# Altium project Audio_Research.PrjPcb (part 1 of 4)
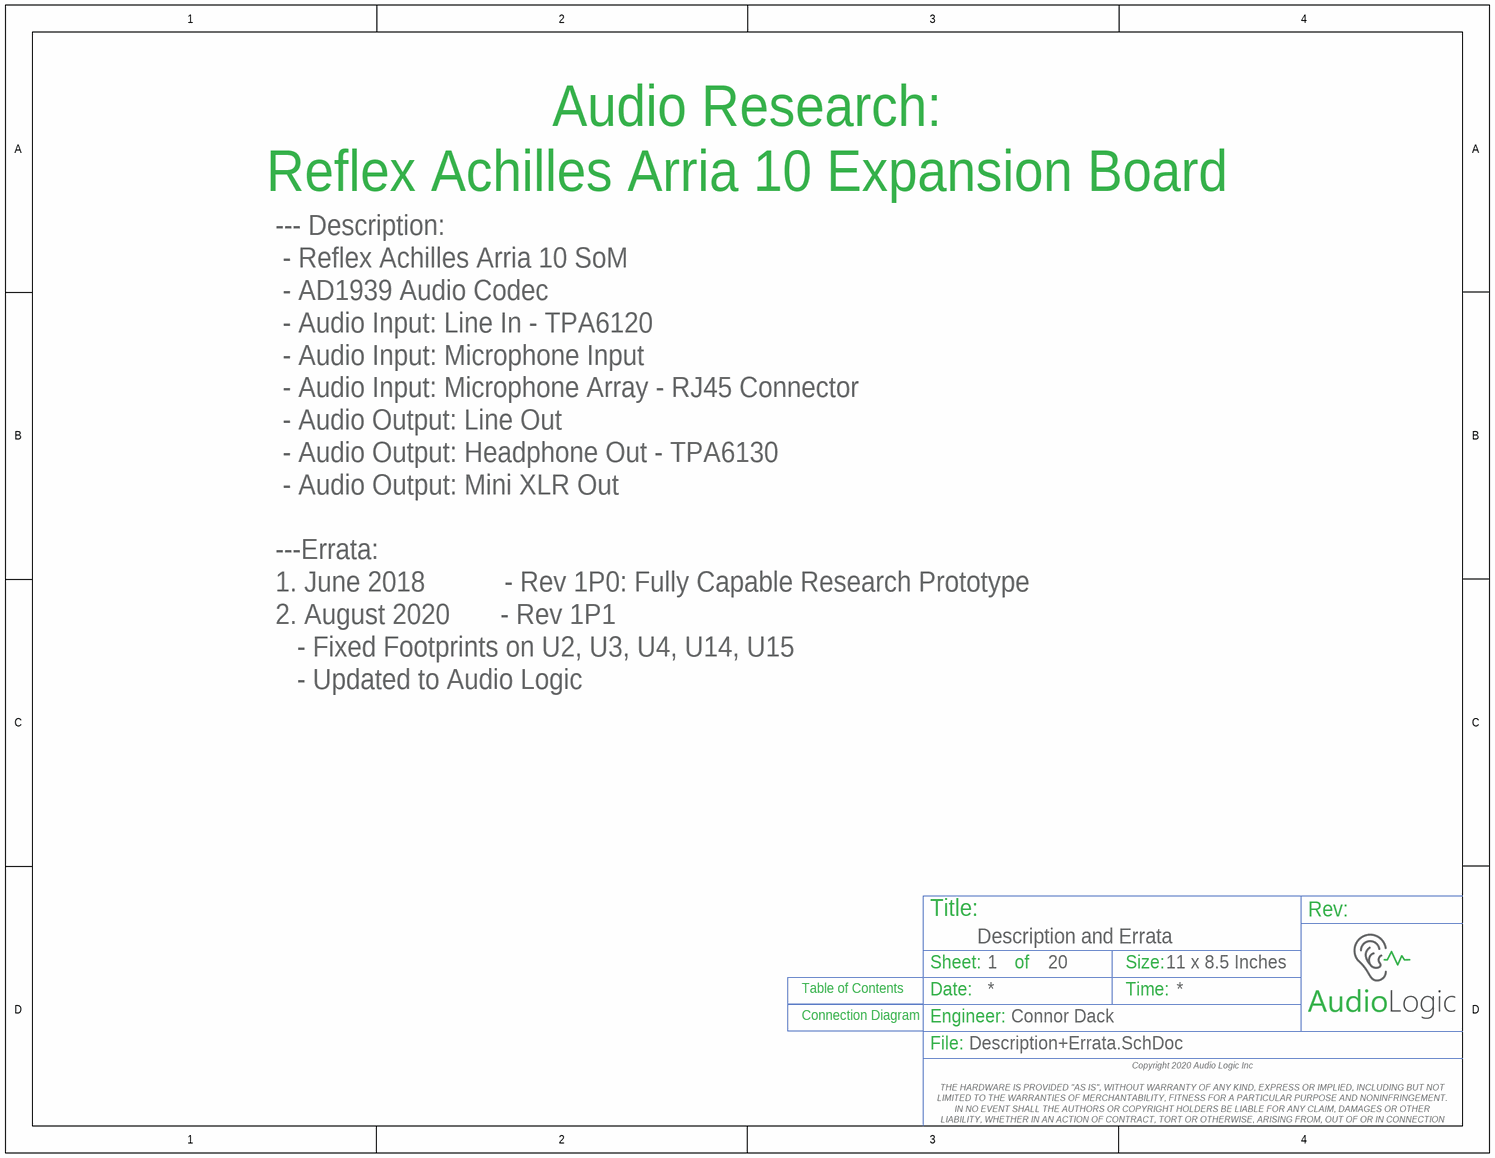
[diagram p0: Description+Errata.SchDoc]
15 sheets, 244 parts. Net scope: flat (ports and power ports of the same name join across sheets).
Board file: Audio_Research.PcbDoc
Sheets:
  Description+Errata.SchDoc
    Table of Contents = ToC.SchDoc
    Connection Diagram = TopLevel.SchDoc
      AUDIO CODEC = Audio_Codec.SchDoc
      LINE IN = Audio_Input_Line_In.SchDoc
      POWER = Power.SchDoc
      LINE OUT = Audio_Output_Line_Out.SchDoc
      BALANCED MINI XLR 1 = Audio_Output_XLR1.SchDoc
      BALANCED MINI XLR 2 = Audio_Output_XLR2.SchDoc
      MICROPHONE IN = Audio_Input_Mic_In.SchDoc
      MEMS MICROPHONE ARRAY = Audio_Input_Mic_Array.SchDoc
      MICROPHONE PREAMP = Audio_Input_Mic_Preamp.SchDoc
      Digital MEMS Microphones = Audio_Input_Digitial_Mic.SchDoc
      FMC BLOCK DIAGRAM = FMC_Block_Diagram.SchDoc
        TOP LPC FEMALE FMC CONN = LPC_Female_FMC.SchDoc

## Sheet Description+Errata.SchDoc: Description and Errata
size 279 x 215 mm; DrawnBy: Connor Dack; Engineer: Connor Dack; DocumentNumber: 1; Revision: 1.0; SheetNumber: 1; SheetTotal: 20

### Sub-sheets
Connection Diagram = TopLevel.SchDoc: no entries
Table of Contents = ToC.SchDoc: no entries

### Notes on the sheet
- Audio Research:
  Reflex Achilles Arria 10 Expansion Board
- --- Description:
  - Reflex Achilles Arria 10 SoM
  - AD1939 Audio Codec
  - Audio Input: Line In - TPA6120
  - Audio Input: Microphone Input
  - Audio Input: Microphone Array - RJ45 Connector
  - Audio Output: Line Out
  - Audio Output: Headphone Out - TPA6130
  - Audio Output: Mini XLR Out
  ---Errata:
  1. June 2018           - Rev 1P0: Fully Capable Research Prototype
  2. August 2020       - Rev 1P1
  - Fixed Footprints on U2, U3, U4, U14, U15
  - Updated to Audio Logic
- Title:
- Sheet:
- of
- Size:
- 11 x 8.5 Inches
- Rev:
- Date:
- Engineer:
- Time:
- File:
- Copyright 2020 Audio Logic Inc
  THE HARDWARE IS PROVIDED "AS IS", WITHOUT WARRANTY OF ANY KIND, EXPRESS OR IMPLIED, INCLUDING BUT NOT LIMITED TO THE WARRANTIES OF MERCHANTABILITY, FITNESS FOR A PARTICULAR PURPOSE AND NONINFRINGEMENT. IN NO EVENT SHALL THE AUTHORS OR COPYRIGHT HOLDERS BE LIABLE FOR ANY CLAIM, DAMAGES OR OTHER LIABILITY, WHETHER IN AN ACTION OF CONTRACT, TORT OR OTHERWISE, ARISING FROM, OUT OF OR IN CONNECTION WITH THE HARDWARE OR THE USE OR OTHER DEALINGS IN THE HARDWARE.

## Sheet ToC.SchDoc: Table of Contents
size 279 x 215 mm; DrawnBy: Connor Dack; Engineer: Connor Dack; DocumentNumber: 2; Revision: 1P2; SheetNumber: 2; SheetTotal: 20
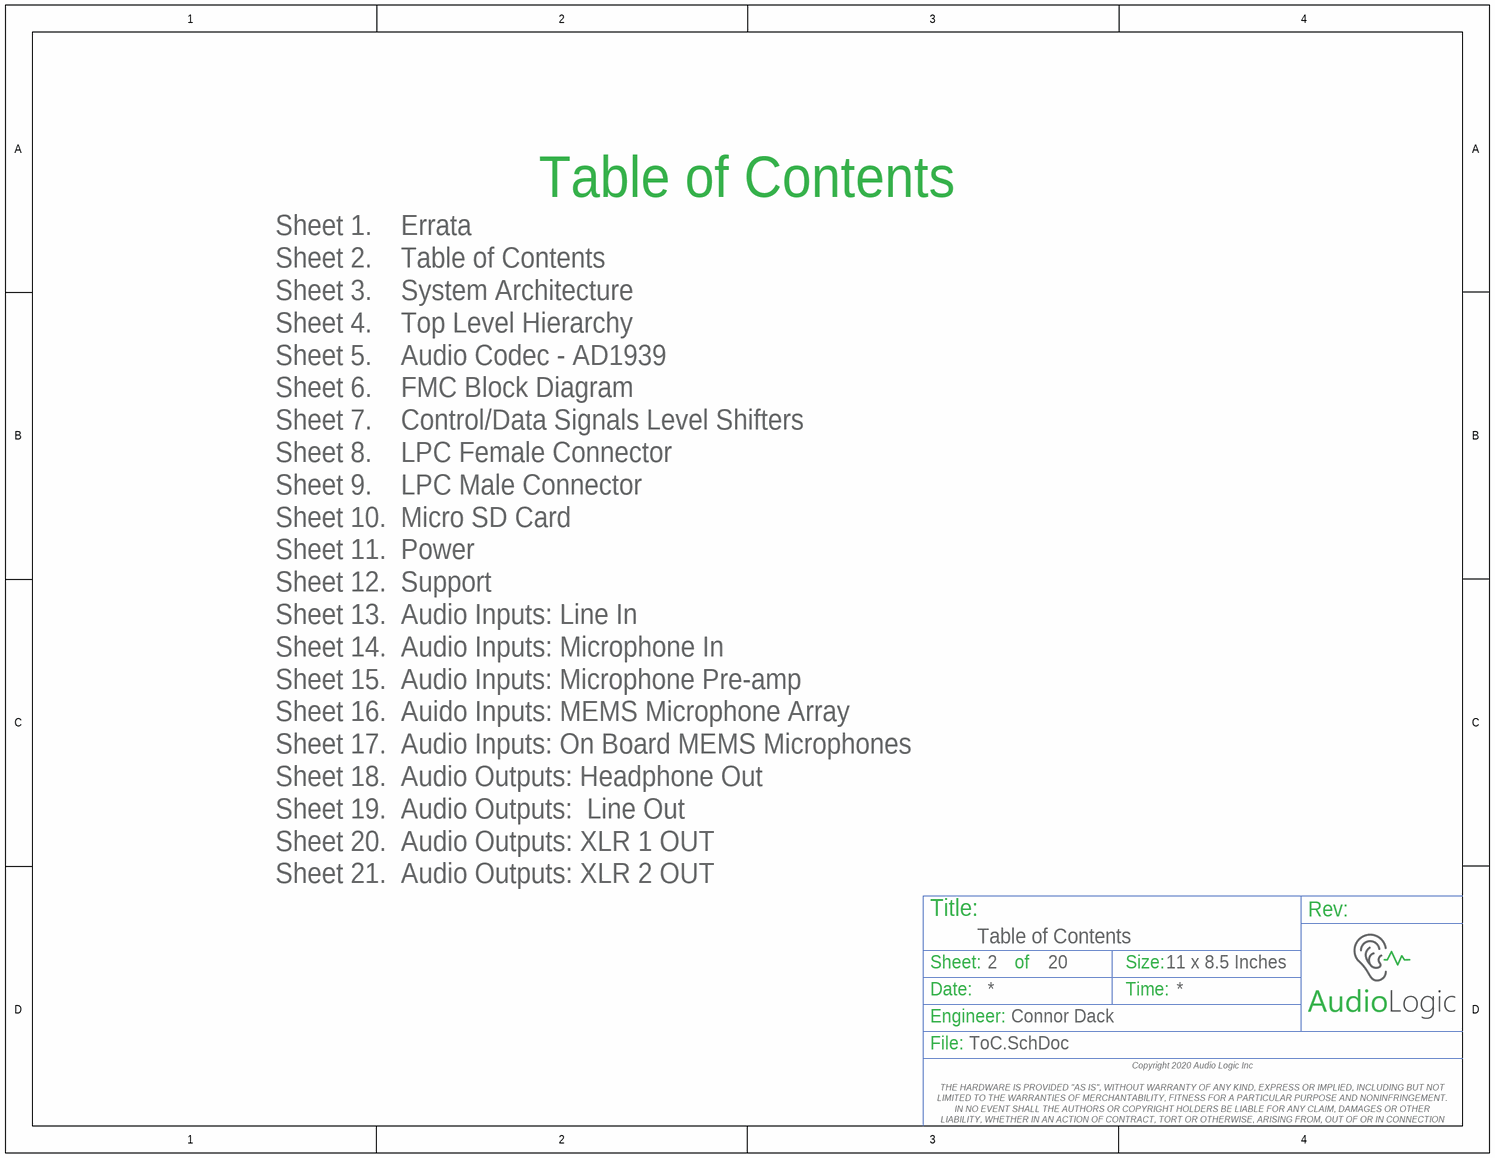
[diagram p1: ToC.SchDoc]

### Notes on the sheet
- Table of Contents
- Sheet 1.    Errata
  Sheet 2.    Table of Contents
  Sheet 3.    System Architecture
  Sheet 4.    Top Level Hierarchy
  Sheet 5.    Audio Codec - AD1939
  Sheet 6.    FMC Block Diagram
  Sheet 7.    Control/Data Signals Level Shifters
  Sheet 8.    LPC Female Connector
  Sheet 9.    LPC Male Connector
  Sheet 10.  Micro SD Card
  Sheet 11.  Power
  Sheet 12.  Support
  Sheet 13.  Audio Inputs: Line In
  Sheet 14.  Audio Inputs: Microphone In
  Sheet 15.  Audio Inputs: Microphone Pre-amp
  Sheet 16.  Auido Inputs: MEMS Microphone Array
  Sheet 17.  Audio Inputs: On Board MEMS Microphones
  Sheet 18.  Audio Outputs: Headphone Out
  Sheet 19.  Audio Outputs:  Line Out
  Sheet 20.  Audio Outputs: XLR 1 OUT
  Sheet 21.  Audio Outputs: XLR 2 OUT
- Title:
- Sheet:
- of
- Size:
- 11 x 8.5 Inches
- Rev:
- Date:
- Engineer:
- Time:
- File:
- Copyright 2020 Audio Logic Inc
  THE HARDWARE IS PROVIDED "AS IS", WITHOUT WARRANTY OF ANY KIND, EXPRESS OR IMPLIED, INCLUDING BUT NOT LIMITED TO THE WARRANTIES OF MERCHANTABILITY, FITNESS FOR A PARTICULAR PURPOSE AND NONINFRINGEMENT. IN NO EVENT SHALL THE AUTHORS OR COPYRIGHT HOLDERS BE LIABLE FOR ANY CLAIM, DAMAGES OR OTHER LIABILITY, WHETHER IN AN ACTION OF CONTRACT, TORT OR OTHERWISE, ARISING FROM, OUT OF OR IN CONNECTION WITH THE HARDWARE OR THE USE OR OTHER DEALINGS IN THE HARDWARE.

## Sheet TopLevel.SchDoc: Top Level Hierarchy
size 279 x 215 mm; DrawnBy: Connor Dack; DocumentNumber: 3; Revision: 1.0; SheetNumber: 3; SheetTotal: 20
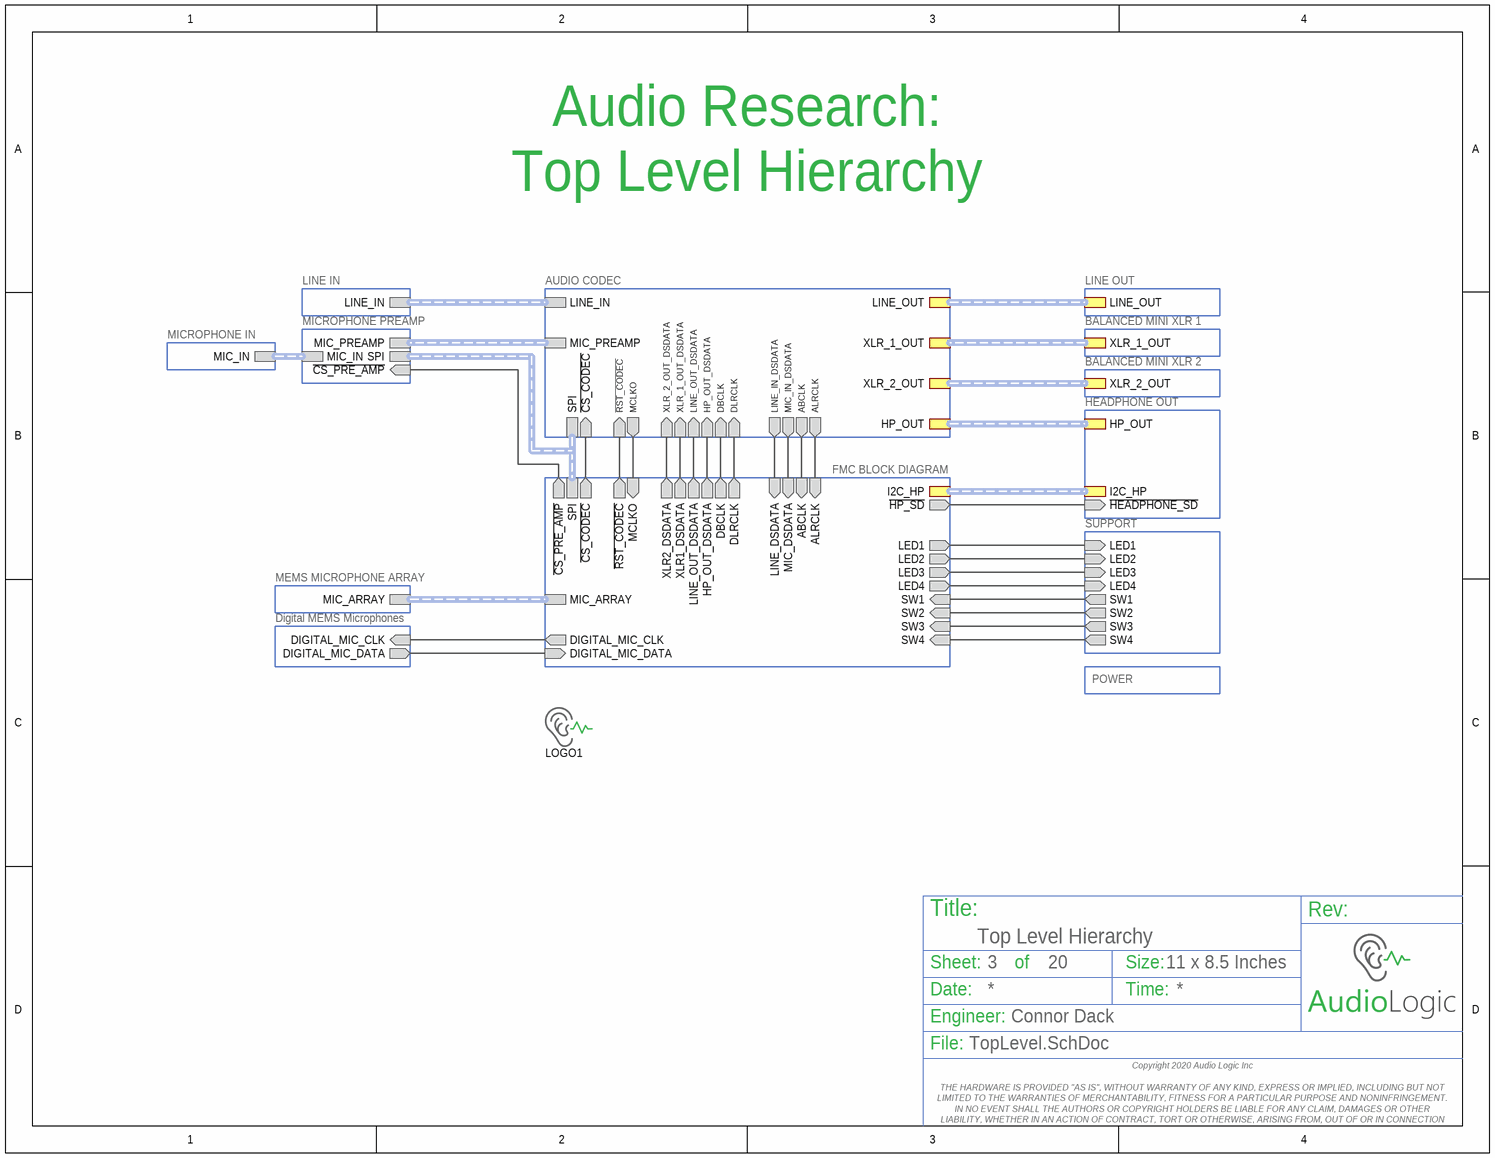
[diagram p2: TopLevel.SchDoc]

### Parts
LOGO1  Audio Logic Logo  [AL_Logo_Small_Silkscreen]  (value not drawn)  (no BOM)

### Sub-sheets
AUDIO CODEC = Audio_Codec.SchDoc: MIC_IN_DSDATA (out), ABCLK (out), ALRCLK (out), DBCLK (in), DLRCLK (in), MCLKO (out), ~{RST_CODEC} (in), HP_OUT_DSDATA (in), LINE_IN (harness LINE_IN), HP_OUT (harness HP_OUT), XLR_1_OUT_DSDATA (in), LINE_IN_DSDATA (out), LINE_OUT_DSDATA (in), XLR_2_OUT_DSDATA (in), LINE_OUT (harness LINE_OUT), MIC_PREAMP (harness MIC_PREAMP), XLR_1_OUT (harness XLR_1_OUT), SPI (harness SPI), ~{CS_CODEC} (in), XLR_2_OUT (harness XLR_2_OUT)
BALANCED MINI XLR 1 = Audio_Output_XLR1.SchDoc: XLR_1_OUT (harness MIC_IN)
BALANCED MINI XLR 2 = Audio_Output_XLR2.SchDoc: XLR_2_OUT (harness XLR_2_OUT)
Digital MEMS Microphones = Audio_Input_Digitial_Mic.SchDoc: DIGITAL_MIC_CLK (in), DIGITAL_MIC_DATA (out)
FMC BLOCK DIAGRAM = FMC_Block_Diagram.SchDoc: DIGITAL_MIC_CLK (out), DIGITAL_MIC_DATA (in), MIC_ARRAY (harness Microphone Array), LED1 (out), LED2 (out), LED3 (out), LED4 (out), SW1 (in), SW2 (in), SW3 (in), SW4 (in), ~{HP_SD} (out), ~{CS_PRE_AMP} (out), ~{CS_CODEC} (out), ~{RST_CODEC} (out), XLR2_DSDATA (out), DBCLK (out), DLRCLK (out), LINE_DSDATA (in), MIC_DSDATA (in), ABCLK (in), ALRCLK (in), XLR1_DSDATA (out), LINE_OUT_DSDATA (out), HP_OUT_DSDATA (out), SPI (harness SPI), I2C_HP (harness I2C_Headphone), MCLKO (in)
HEADPHONE OUT = Audio_Output_Headphone.SchDoc (file not in this document): HP_OUT (harness HP_OUT), ~{HEADPHONE_SD} (in), I2C_HP (harness I2C_Headphone)
LINE IN = Audio_Input_Line_In.SchDoc: LINE_IN (harness MIC_IN)
LINE OUT = Audio_Output_Line_Out.SchDoc: LINE_OUT (harness MIC_IN)
MEMS MICROPHONE ARRAY = Audio_Input_Mic_Array.SchDoc: MIC_ARRAY (harness Microphone Array)
MICROPHONE IN = Audio_Input_Mic_In.SchDoc: MIC_IN (harness MIC_IN)
MICROPHONE PREAMP = Audio_Input_Mic_Preamp.SchDoc: MIC_PREAMP (harness MIC_PREAMP), SPI (harness SPI), ~{CS_PRE_AMP} (in), MIC_IN (harness MIC_IN)
POWER = Power.SchDoc: no entries
SUPPORT = Support.SchDoc (file not in this document): SW1 (out), SW2 (out), SW3 (out), SW4 (out), LED1 (in), LED2 (in), LED3 (in), LED4 (in)

### Nets
(unnamed): sheet AUDIO CODEC/MIC_IN_DSDATA, sheet FMC BLOCK DIAGRAM/MIC_DSDATA
(unnamed): sheet AUDIO CODEC/ABCLK, sheet FMC BLOCK DIAGRAM/ABCLK
(unnamed): sheet AUDIO CODEC/ALRCLK, sheet FMC BLOCK DIAGRAM/ALRCLK
(unnamed): sheet AUDIO CODEC/DBCLK, sheet FMC BLOCK DIAGRAM/DBCLK
(unnamed): sheet AUDIO CODEC/DLRCLK, sheet FMC BLOCK DIAGRAM/DLRCLK
(unnamed): sheet AUDIO CODEC/MCLKO, sheet FMC BLOCK DIAGRAM/MCLKO
(unnamed): sheet AUDIO CODEC/~{RST_CODEC}, sheet FMC BLOCK DIAGRAM/~{RST_CODEC}
(unnamed): sheet AUDIO CODEC/HP_OUT_DSDATA, sheet FMC BLOCK DIAGRAM/HP_OUT_DSDATA
(unnamed): sheet AUDIO CODEC/XLR_1_OUT_DSDATA, sheet FMC BLOCK DIAGRAM/XLR1_DSDATA
(unnamed): sheet AUDIO CODEC/LINE_IN_DSDATA, sheet FMC BLOCK DIAGRAM/LINE_DSDATA
(unnamed): sheet AUDIO CODEC/LINE_OUT_DSDATA, sheet FMC BLOCK DIAGRAM/LINE_OUT_DSDATA
(unnamed): sheet AUDIO CODEC/XLR_2_OUT_DSDATA, sheet FMC BLOCK DIAGRAM/XLR2_DSDATA
(unnamed): sheet AUDIO CODEC/~{CS_CODEC}, sheet FMC BLOCK DIAGRAM/~{CS_CODEC}
(unnamed): sheet HEADPHONE OUT/~{HEADPHONE_SD}, sheet FMC BLOCK DIAGRAM/~{HP_SD}
(unnamed): sheet SUPPORT/SW1, sheet FMC BLOCK DIAGRAM/SW1
(unnamed): sheet SUPPORT/SW2, sheet FMC BLOCK DIAGRAM/SW2
(unnamed): sheet SUPPORT/SW3, sheet FMC BLOCK DIAGRAM/SW3
(unnamed): sheet SUPPORT/SW4, sheet FMC BLOCK DIAGRAM/SW4
(unnamed): sheet SUPPORT/LED1, sheet FMC BLOCK DIAGRAM/LED1
(unnamed): sheet SUPPORT/LED2, sheet FMC BLOCK DIAGRAM/LED2
(unnamed): sheet SUPPORT/LED3, sheet FMC BLOCK DIAGRAM/LED3
(unnamed): sheet SUPPORT/LED4, sheet FMC BLOCK DIAGRAM/LED4
(unnamed): sheet MICROPHONE PREAMP/~{CS_PRE_AMP}, sheet FMC BLOCK DIAGRAM/~{CS_PRE_AMP}
(unnamed): sheet Digital MEMS Microphones/DIGITAL_MIC_CLK, sheet FMC BLOCK DIAGRAM/DIGITAL_MIC_CLK
(unnamed): sheet Digital MEMS Microphones/DIGITAL_MIC_DATA, sheet FMC BLOCK DIAGRAM/DIGITAL_MIC_DATA

### Buses and harness runs
harness sheet AUDIO CODEC/HP_OUT = sheet HEADPHONE OUT/HP_OUT
harness sheet AUDIO CODEC/LINE_IN = sheet LINE IN/LINE_IN
harness sheet AUDIO CODEC/LINE_OUT = sheet LINE OUT/LINE_OUT
harness sheet AUDIO CODEC/MIC_PREAMP = sheet MICROPHONE PREAMP/MIC_PREAMP
harness sheet AUDIO CODEC/SPI = sheet FMC BLOCK DIAGRAM/SPI = sheet MICROPHONE PREAMP/SPI
harness sheet AUDIO CODEC/XLR_1_OUT = sheet BALANCED MINI XLR 1/XLR_1_OUT
harness sheet AUDIO CODEC/XLR_2_OUT = sheet BALANCED MINI XLR 2/XLR_2_OUT
harness sheet FMC BLOCK DIAGRAM/I2C_HP = sheet HEADPHONE OUT/I2C_HP
harness sheet FMC BLOCK DIAGRAM/MIC_ARRAY = sheet MEMS MICROPHONE ARRAY/MIC_ARRAY
harness sheet MICROPHONE IN/MIC_IN = sheet MICROPHONE PREAMP/MIC_IN

### Notes on the sheet
- Audio Research:
  Top Level Hierarchy
- Title:
- Sheet:
- of
- Size:
- 11 x 8.5 Inches
- Rev:
- Date:
- Engineer:
- Time:
- File:
- Copyright 2020 Audio Logic Inc
  THE HARDWARE IS PROVIDED "AS IS", WITHOUT WARRANTY OF ANY KIND, EXPRESS OR IMPLIED, INCLUDING BUT NOT LIMITED TO THE WARRANTIES OF MERCHANTABILITY, FITNESS FOR A PARTICULAR PURPOSE AND NONINFRINGEMENT. IN NO EVENT SHALL THE AUTHORS OR COPYRIGHT HOLDERS BE LIABLE FOR ANY CLAIM, DAMAGES OR OTHER LIABILITY, WHETHER IN AN ACTION OF CONTRACT, TORT OR OTHERWISE, ARISING FROM, OUT OF OR IN CONNECTION WITH THE HARDWARE OR THE USE OR OTHER DEALINGS IN THE HARDWARE.

### Library data of the parts
LOGO1 = Audio_Logic_Logo

## Sheet Audio_Codec.SchDoc: Audio Codec
size 279 x 215 mm; DrawnBy: Connor Dack; Engineer: Connor Dack; DocumentNumber: 4; Revision: 1.0; SheetNumber: 4; SheetTotal: 20
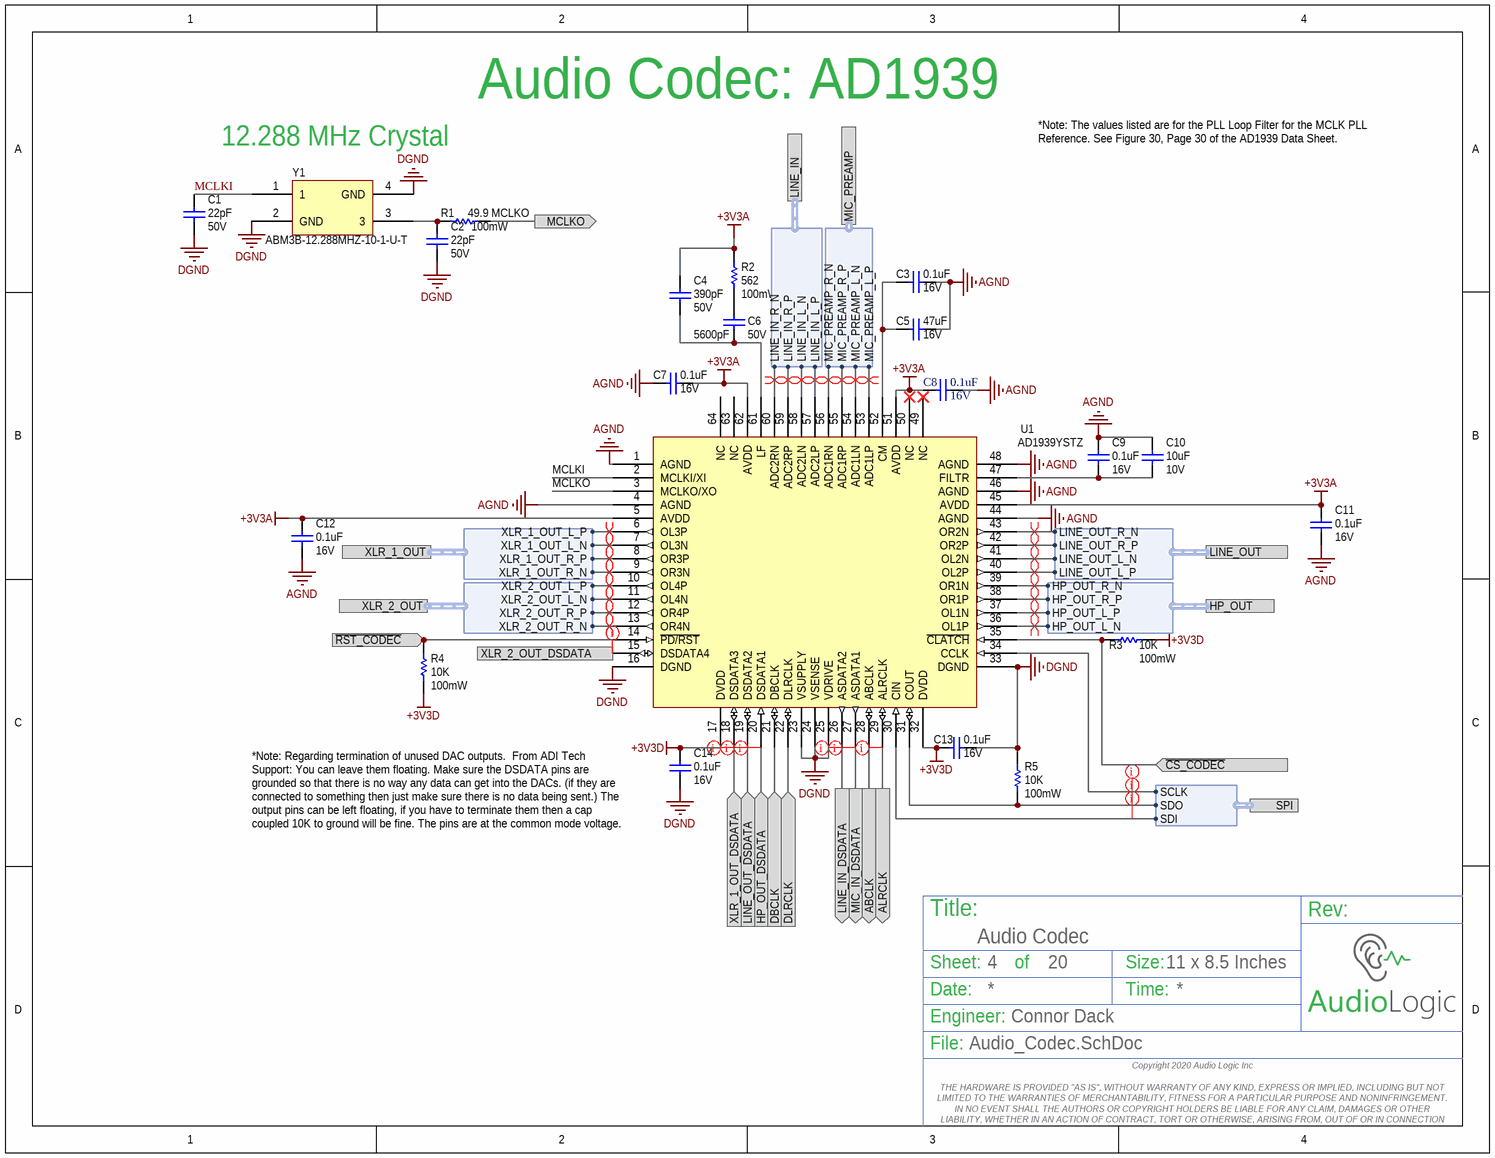
[diagram p3: Audio_Codec.SchDoc]

### Parts
C1  Voltage Rating: 50V  Capacitance: 22pF  [3-0603_L]  (hidden comment: CGA3E2C0G1H220J080AA)
C2  Voltage Rating: 50V  Capacitance: 22pF  [3-0603_L]  (hidden comment: CGA3E2C0G1H220J080AA)
C3  Voltage Rating: 16V  Capacitance: 0.1uF  [3-0603_L]  (hidden comment: CL10F104ZO8NNNC)
C4  Voltage - Rated: 50V  Capacitance: 390pF  [3-0603_L]  (hidden comment: CL10B391KB8NNNC)
C5  Voltage Rating: 16V  Capacitance: 47uF  [C1210X25_L]  (hidden comment: CL32A476KOJNNNE)
C6  Voltage - Rated: 50V  Capacitance: 5600pF  [3-0603_L]  (hidden comment: CL10B562KB8SFNC)
C7  Voltage Rating: 16V  Capacitance: 0.1uF  [3-0603_L]  (hidden comment: CL10F104ZO8NNNC)
C8  Voltage Rating: 16V  Capacitance: 0.1uF  [3-0603_L]  (hidden comment: CL10F104ZO8NNNC)
C9  Voltage Rating: 16V  Capacitance: 0.1uF  [3-0603_L]  (hidden comment: CL10F104ZO8NNNC)
C10  Voltage Rating: 10V  Capacitance: 10uF  [3-0603_L]  (hidden comment: GRM188R61A106ME69D)
C11  Voltage Rating: 16V  Capacitance: 0.1uF  [3-0603_L]  (hidden comment: CL10F104ZO8NNNC)
C12  Voltage Rating: 16V  Capacitance: 0.1uF  [3-0603_L]  (hidden comment: CL10F104ZO8NNNC)
C13  Voltage Rating: 16V  Capacitance: 0.1uF  [3-0603_L]  (hidden comment: CL10F104ZO8NNNC)
C14  Voltage Rating: 16V  Capacitance: 0.1uF  [3-0603_L]  (hidden comment: CL10F104ZO8NNNC)
R1  Power (Watts): 100mW  Resistance (Ohms): 49.9  [3-0603_R_L]  (hidden comment: ERJ-3EKF49R9V)
R2  Power (Watts): 100mW  Resistance (Ohms): 562  [3-0603_R_L]  (hidden comment: ERJ-3EKF5620V)
R3  Power (Watts): 100mW  Resistance (Ohms): 10K  [3-0603_R_L]  (hidden comment: ERJ-3GEYJ103V)
R4  Power (Watts): 100mW  Resistance (Ohms): 10K  [3-0603_R_L]  (hidden comment: ERJ-3GEYJ103V)
R5  Power (Watts): 100mW  Resistance (Ohms): 10K  [3-0603_R_L]  (hidden comment: ERJ-3GEYJ103V)
U1  AD1939YSTZ  [ST_64_2]
Y1  ABM3B-12.288MHZ-10-1-U-T  [ADM3B]

### Ports
ABCLK (out), ALRCLK (out), DBCLK (in), DLRCLK (in), HP_OUT (harness HP_OUT), HP_OUT_DSDATA (in), LINE_IN (harness LINE_IN), LINE_IN_DSDATA (out), LINE_OUT (harness LINE_OUT), LINE_OUT_DSDATA (in), MCLKO (out), MIC_IN_DSDATA (out), MIC_PREAMP (harness MIC_PREAMP), SPI (harness SPI), XLR_1_OUT (harness XLR_1_OUT), XLR_1_OUT_DSDATA (in), XLR_2_OUT (harness XLR_2_OUT), XLR_2_OUT_DSDATA (in), ~{CS_CODEC} (in), ~{RST_CODEC} (in)

### Harnesses
LINE_IN: LINE_IN_R_P, LINE_IN_R_N, LINE_IN_L_N, LINE_IN_L_P
HP_OUT: HP_OUT_L_N, HP_OUT_L_P, HP_OUT_R_N, HP_OUT_R_P
LINE_OUT: LINE_OUT_L_N, LINE_OUT_L_P, LINE_OUT_R_N, LINE_OUT_R_P
XLR_1_OUT: XLR_1_OUT_L_N, XLR_1_OUT_L_P, XLR_1_OUT_R_N, XLR_1_OUT_R_P
XLR_2_OUT: XLR_2_OUT_L_N, XLR_2_OUT_L_P, XLR_2_OUT_R_N, XLR_2_OUT_R_P
MIC_PREAMP: MIC_PREAMP_R_P, MIC_PREAMP_R_N, MIC_PREAMP_L_N, MIC_PREAMP_L_P
SPI: SDI, SCLK, SDO

### Nets
+3V3A: C4.1 C7.1 C8.2 C11.1 C12.1 R2.1 U1.5(AVDD) U1.45(AVDD) U1.51(AVDD) U1.62(AVDD)
+3V3D: C13.2 C14.1 R3.1 R4.1 U1.17(DVDD) U1.32(DVDD)
AGND: C1.1 C2.1 C3.1 C5.2 C7.2 C8.1 C9.1 C10.2 C11.2 C12.2 C13.1 C14.2 R5.1 U1.1(AGND) U1.4(AGND) U1.16(DGND) U1.23(VSUPPLY) U1.24(VSENSE) U1.25(VDRIVE) U1.33(DGND) U1.44(AGND) U1.46(AGND) U1.48(AGND) Y1.2(GND) Y1.4(GND)  [also labelled DGND]
~{CS_CODEC}: R3.2 U1.35(~{CLATCH}) ; port ~{CS_CODEC}
ABCLK: U1.28(ABCLK) ; port ABCLK
ALRCLK: U1.29(ALRCLK) ; port ALRCLK
DBCLK: U1.21(DBCLK) ; port DBCLK
DLRCLK: U1.22(DLRCLK) ; port DLRCLK
HP_OUT_DSDATA: U1.20(DSDATA1) ; port HP_OUT_DSDATA
LINE_IN_DSDATA: U1.26(ASDATA2) ; port LINE_IN_DSDATA
LINE_OUT_DSDATA: U1.19(DSDATA2) ; port LINE_OUT_DSDATA
MCLKI: C1.2 U1.2(MCLKI/XI) Y1.1
MCLKO: R1.2 U1.3(MCLKO/XO) ; port MCLKO
MIC_IN_DSDATA: U1.27(ASDATA1) ; port MIC_IN_DSDATA
~{RST_CODEC}: R4.2 U1.14(~{PD/RST}) ; port ~{RST_CODEC}
SCLK: U1.34(CCLK) ; port SPI.SCLK
SDI: U1.30(CIN) ; port SPI.SDI
SDO: R5.2 U1.31(COUT) ; port SPI.SDO
XLR_1_OUT_DSDATA: U1.18(DSDATA3) ; port XLR_1_OUT_DSDATA
XLR_2_OUT_DSDATA: U1.15(DSDATA4) ; port XLR_2_OUT_DSDATA
NetC2_2: C2.2 R1.1 Y1.3
NetC3_2: C3.2 C5.1 U1.52(CM)
NetC4_2: C4.2 C6.2 U1.61(LF)
NetC6_1: C6.1 R2.2
NetC9_2: C9.2 C10.1 U1.47(FILTR)
NetC52_1: U1.58(ADC2LN) ; port LINE_IN.LINE_IN_L_N
NetC55_1: U1.57(ADC2LP) ; port LINE_IN.LINE_IN_L_P
NetC62_1: U1.60(ADC2RN) ; port LINE_IN.LINE_IN_R_N
NetC64_1: U1.59(ADC2RP) ; port LINE_IN.LINE_IN_R_P
NetR68_1: U1.40(OL2P) ; port LINE_OUT.LINE_OUT_L_P
NetR70_1: U1.41(OL2N) ; port LINE_OUT.LINE_OUT_L_N
NetR71_1: U1.43(OR2N) ; port LINE_OUT.LINE_OUT_R_N
NetR73_1: U1.42(OR2P) ; port LINE_OUT.LINE_OUT_R_P
NetU1_6: U1.6(OL3P) ; port XLR_1_OUT.XLR_1_OUT_L_P
NetU1_7: U1.7(OL3N) ; port XLR_1_OUT.XLR_1_OUT_L_N
NetU1_8: U1.8(OR3P) ; port XLR_1_OUT.XLR_1_OUT_R_P
NetU1_9: U1.9(OR3N) ; port XLR_1_OUT.XLR_1_OUT_R_N
NetU1_10: U1.10(OL4P) ; port XLR_2_OUT.XLR_2_OUT_L_P
NetU1_11: U1.11(OL4N) ; port XLR_2_OUT.XLR_2_OUT_L_N
NetU1_12: U1.12(OR4P) ; port XLR_2_OUT.XLR_2_OUT_R_P
NetU1_13: U1.13(OR4N) ; port XLR_2_OUT.XLR_2_OUT_R_N
NetU1_36: U1.36(OL1P) ; port HP_OUT.HP_OUT_L_N
NetU1_37: U1.37(OL1N) ; port HP_OUT.HP_OUT_L_P
NetU1_38: U1.38(OR1P) ; port HP_OUT.HP_OUT_R_P
NetU1_39: U1.39(OR1N) ; port HP_OUT.HP_OUT_R_N
NetU1_53: U1.53(ADC1LP) ; port MIC_PREAMP.MIC_PREAMP_L_P
NetU1_54: U1.54(ADC1LN) ; port MIC_PREAMP.MIC_PREAMP_L_N
NetU1_55: U1.55(ADC1RP) ; port MIC_PREAMP.MIC_PREAMP_R_P
NetU1_56: U1.56(ADC1RN) ; port MIC_PREAMP.MIC_PREAMP_R_N

Not connected (* = marked no-connect by the designer): U1 49(NC)* 50(NC)* 63(NC) 64(NC)

### Layout directives
differential pair: NetC52_1, NetC55_1, NetC62_1, NetC64_1, NetR68_1, NetR70_1, NetR71_1, NetR73_1, NetU1_6, NetU1_7, NetU1_8, NetU1_9, NetU1_10, NetU1_11, NetU1_12, NetU1_13, NetU1_36, NetU1_37, NetU1_38, NetU1_39, NetU1_53, NetU1_54, NetU1_55, NetU1_56
net class SPI: SCLK, SDI, SDO
net class FPGA_Audio_In: ALRCLK, LINE_IN_DSDATA, MIC_IN_DSDATA
net class FPGA_Audio_Out: HP_OUT_DSDATA, LINE_OUT_DSDATA, XLR_1_OUT_DSDATA, XLR_2_OUT_DSDATA

### Notes on the sheet
- 12.288 MHz Crystal
- Audio Codec: AD1939
- *Note: The values listed are for the PLL Loop Filter for the MCLK PLL Reference. See Figure 30, Page 30 of the AD1939 Data Sheet.
- *Note: Regarding termination of unused DAC outputs.  From ADI Tech Support: You can leave them floating. Make sure the DSDATA pins are grounded so that there is no way any data can get into the DACs. (if they are connected to something then just make sure there is no data being sent.) The output pins can be left floating, if you have to terminate them then a cap coupled 10K to ground will be fine. The pins are at the common mode voltage.
- Title:
- Sheet:
- of
- Size:
- 11 x 8.5 Inches
- Rev:
- Date:
- Engineer:
- Time:
- File:
- Copyright 2020 Audio Logic Inc
  THE HARDWARE IS PROVIDED "AS IS", WITHOUT WARRANTY OF ANY KIND, EXPRESS OR IMPLIED, INCLUDING BUT NOT LIMITED TO THE WARRANTIES OF MERCHANTABILITY, FITNESS FOR A PARTICULAR PURPOSE AND NONINFRINGEMENT. IN NO EVENT SHALL THE AUTHORS OR COPYRIGHT HOLDERS BE LIABLE FOR ANY CLAIM, DAMAGES OR OTHER LIABILITY, WHETHER IN AN ACTION OF CONTRACT, TORT OR OTHERWISE, ARISING FROM, OUT OF OR IN CONNECTION WITH THE HARDWARE OR THE USE OR OTHER DEALINGS IN THE HARDWARE.

### Library data of the parts
C1 C2 = CGA3E2C0G1H220J080AA: CAP CER 22PF 50V C0G 0603; Manufacturer: TDK; Tolerance: 5%; ComponentLink1URL: https://datasheet.ciiva.com/24217/cga3e2c0g1h220j080aa-265896-24217329.pdf; ComponentLink1Description: https://datasheet.ciiva.com/24217/cga3e2c0g1h220j080aa-265896-24217329.pdf; Supplier 1: Digi-Key; Manufacturer Part Number: CGA3E2C0G1H220J080AA; Stock 1: 26658; Pricing 1: 1=0.1, 10=0.063, 100=0.0279, 500=0.0199, 1000=0.0156 (USD); Mount: Surface Mount; Case/Package: 0603; Weight: 7.1E-05oz; Case Code (Imperial): 0603; Case Code (Metric): 1608; Min Operating Temperature: -55°C; Max Operating Temperature: 125°C; Voltage Rating (DC): 50V; Packaging: Tape and Reel; Package Quantity: 1; Dielectric: C0G; Termination: SMD/SMT; Composition: Ceramic; Length: 1.6mm; Height: 0.8mm; Width: 0.8mm; Thickness: 0.035inch; Depth: 0.8mm; REACH SVHC: No SVHC; Lead Free: Lead Free; Supplier Part Number 1: 445-5632-6-ND
C3 C7-C9 C11-C14 = CL10F104ZO8NNNC: CAP CER 0.1UF 16V Y5V 0603; Manufacturer: Samsung; Tolerance: 80%; Supplier 1: Digi-Key; Stock 1: 40000; Pricing 1: 1=0.1, 10=0.038, 100=0.0169, 500=0.01208, 1000=0.00949 (USD); Mount: Surface Mount; Case/Package: 0603; Case Code (Metric): 1608; Case Code (Imperial): 0603; Min Operating Temperature: -30°C; Max Operating Temperature: 85°C; Package Quantity: 1; Packaging: Tape and Reel; Dielectric: Y5V; Length: 1.6mm; Height: 0.8mm; Width: 0.031inch; Thickness: 0.035inch; Depth: 0.8mm; Radiation Hardening: No; ComponentLink1URL: https://datasheet.ciiva.com/25805/cl10f104zo8nnnc-25805810.pdf; ComponentLink1Description: https://datasheet.ciiva.com/25805/cl10f104zo8nnnc-25805810.pdf; ComponentLink2URL: https://datasheet.ciiva.com/16199/cl10f104zo8nnnc-16199254.pdf; ComponentLink2Description: https://datasheet.ciiva.com/16199/cl10f104zo8nnnc-16199254.pdf; Supplier Part Number 1: 1276-1258-6-ND; Manufacturer Part Number: CL10F104ZO8NNNC
C4 = CL10B391KB8NNNC: 390pF 50V Ceramic Capacitor X7R 0603 (1608 Metric) 0.063" L x 0.031" W (1.60mm x 0.80mm); Manufacturer: Samsung Electro-Mechanics America, Inc.; Tolerance: ±10%; Supplier 1: Digi-Key; Manufacturer Part Number: CL10B391KB8NNNC; RoHS: RoHS Compliant; Category: Capacitors; Stock 1: 10890; Pricing 1: 1=0.1, 10=0.035, 25=0.0248, 50=0.0192, 100=0.0162, 500=0.01132, 1000=0.00882 (USD); Packaging: Cut Tape (CT); Part Status: Active; Temperature Coefficient: X7R; Mounting Type: Surface Mount, MLCC; Operating Temperature: -55°C ~ 125°C; Applications: General Purpose; Ratings: -; Package / Case: 0603 (1608 Metric); Size / Dimension: 0.063" L x 0.031" W (1.60mm x 0.80mm); Height - Seated (Max): -; Thickness (Max): 0.035" (0.90mm); Lead Spacing: -; Features: -; Lead Style: -; ComponentLink1URL: http://www.samsungsem.com/kr/support/product-search/mlcc/__icsFiles/afieldfile/2016/08/18/S_CL10B391KB8NNNC.pdf; ComponentLink1Description: http://www.samsungsem.com/kr/support/product-search/mlcc/__icsFiles/afieldfile/2016/08/18/S_CL10B391KB8NNNC.pdf; Supplier Part Number 1: 1276-2049-1-ND
C5 = CL32A476KOJNNNE: CAP CER 47UF 16V X5R 1210; Manufacturer: Samsung; Tolerance: 10%; Supplier 1: Digi-Key; Manufacturer Part Number: CL32A476KOJNNNE; Stock 1: 10000; Pricing 1: 1=1.12, 10=0.853, 100=0.6104, 500=0.47254 (USD); Mount: Surface Mount; Case/Package: 1210; Case Code (Metric): 3225; Case Code (Imperial): 1210; Min Operating Temperature: -55°C; Max Operating Temperature: 85°C; Package Quantity: 1; Packaging: Tape and Reel; Dielectric: X5R; Voltage Rating (DC): 16V; Length: 0.126inch; Width: 0.098inch; Thickness: 0.106inch; Lead Free: Lead Free; ComponentLink1URL: https://datasheet.ciiva.com/25785/cl32a476kojnnne-25785873.pdf; ComponentLink1Description: https://datasheet.ciiva.com/25785/cl32a476kojnnne-25785873.pdf; Supplier Part Number 1: 1276-3376-6-ND
C6 = CL10B562KB8SFNC: 5600pF 50V Ceramic Capacitor X7R 0603 (1608 Metric) 0.063" L x 0.031" W (1.60mm x 0.80mm); Manufacturer: Samsung Electro-Mechanics America, Inc.; Tolerance: ±10%; Notes: FE Provides; Supplier 1: Digi-Key; Manufacturer Part Number: CL10B562KB8SFNC; RoHS: RoHS Compliant; Category: Capacitors; Stock 1: 35381; Pricing 1: 1=0.1, 10=0.048, 25=0.034, 50=0.0262, 100=0.0221, 500=0.01548, 1000=0.01206 (USD); Packaging: Cut Tape (CT); Part Status: Active; Temperature Coefficient: X7R; Mounting Type: Surface Mount, MLCC; Operating Temperature: -55°C ~ 125°C; Applications: Boardflex Sensitive; Ratings: -; Package / Case: 0603 (1608 Metric); Size / Dimension: 0.063" L x 0.031" W (1.60mm x 0.80mm); Height - Seated (Max): -; Thickness (Max): 0.035" (0.90mm); Lead Spacing: -; Features: Soft Termination; Lead Style: -; ComponentLink1URL: http://www.samsungsem.com/kr/support/product-search/mlcc/__icsFiles/afieldfile/2016/08/18/S_CL10B562KB8SFNC.pdf; ComponentLink1Description: http://www.samsungsem.com/kr/support/product-search/mlcc/__icsFiles/afieldfile/2016/08/18/S_CL10B562KB8SFNC.pdf; Supplier Part Number 1: 1276-2092-1-ND
C10 = GRM188R61A106ME69D: CAP CER 10UF 10V X5R 0603; Manufacturer: Murata; Material: Ceramic; Tolerance: 20%; Supplier 1: Digi-Key; Manufacturer Part Number: GRM188R61A106ME69D; Stock 1: 40000; Pricing 1: 1=0.22, 10=0.149, 100=0.0754, 500=0.05158, 1000=0.04563 (USD); Mount: Surface Mount; Case/Package: 0603; Weight: 0.000222oz; Case Code (Metric): 1608; Case Code (Imperial): 0603; Min Operating Temperature: -55°C; Max Operating Temperature: 85°C; Packaging: Tape and Reel; Dielectric: X5R; Termination: SMD/SMT; Voltage Rating (DC): 10V; Package Quantity: 4000; Length: 1.6mm; Height: 0.8mm; Width: 0.8mm; Thickness: 0.035inch; Depth: 0.8mm; REACH SVHC: Unknown; Lead Free: Lead Free; ComponentLink1URL: http://components.arrow.com/part/dataview/0323_06119472; ComponentLink1Description: http://components.arrow.com/part/dataview/0323_06119472; ComponentLink2URL: http://www.farnell.com/datasheets/2048014.pdf; ComponentLink2Description: http://www.farnell.com/datasheets/2048014.pdf; ComponentLink3URL: http://search.murata.co.jp/Ceramy/image/img/A01X/G101/ENG/GRM188R61A106ME69-01.pdf; ComponentLink3Description: http://search.murata.co.jp/Ceramy/image/img/A01X/G101/ENG/GRM188R61A106ME69-01.pdf; ComponentLink4URL: http://www.mouser.com/ds/2/281/c02e-2905.pdf; ComponentLink4Description: http://www.mouser.com/ds/2/281/c02e-2905.pdf; ComponentLink5URL: http://www.farnell.com/datasheets/1872210.pdf; ComponentLink5Description: http://www.farnell.com/datasheets/1872210.pdf; Supplier Part Number 1: 490-10475-6-ND
R1 = ERJ-3EKF49R9V: RES SMD 49.9 OHM 1% 1/10W 0603; Manufacturer: Panasonic Electronic Components; Temperature Coefficient: ±100ppm/°C; Notes: FE Provides; Supplier 1: Digi-Key; RoHS: RoHS Compliant; Category: Resistors; Stock 1: 1715606; Pricing 1: 1=0.1, 10=0.019, 25=0.0136, 50=0.0104, 100=0.0077, 250=0.00584, 500=0.00468, 1000=0.00345 (USD); Packaging: Cut Tape (CT); Part Status: Active; Tolerance: ±1%; Composition: Thick Film; Features: Automotive AEC-Q200; Operating Temperature: -55°C ~ 155°C; Package / Case: 0603 (1608 Metric); Supplier Device Package: 0603; Size / Dimension: 0.063" L x 0.031" W (1.60mm x 0.80mm); Height - Seated (Max): 0.022" (0.55mm); Number of Terminations: 2; Failure Rate: -; ComponentLink1URL: http://industrial.panasonic.com/www-cgi/jvcr13pz.cgi?E+PZ+3+AOA0002+ERJ3EKF49R9V+7+WW; ComponentLink1Description: http://industrial.panasonic.com/www-cgi/jvcr13pz.cgi?E+PZ+3+AOA0002+ERJ3EKF49R9V+7+WW; Supplier Part Number 1: P49.9HCT-ND
R2 = ERJ-3EKF5620V: RES SMD 562 OHM 1% 1/10W 0603; Manufacturer: Panasonic Electronic Components; Temperature Coefficient: ±100ppm/°C; Supplier 1: Digi-Key; Manufacturer Part Number: ERJ-3EKF5620V; RoHS: RoHS Compliant; Category: Resistors; Stock 1: 336376; Pricing 1: 1=0.1, 50=0.0114, 100=0.0084, 250=0.00644, 500=0.00514, 1000=0.00379 (USD); Packaging: Cut Tape (CT); Part Status: Active; Tolerance: ±1%; Composition: Thick Film; Features: Automotive AEC-Q200; Operating Temperature: -55°C ~ 155°C; Package / Case: 0603 (1608 Metric); Supplier Device Package: 0603; Size / Dimension: 0.063" L x 0.031" W (1.60mm x 0.80mm); Height: 0.022" (0.55mm); Number of Terminations: 2; Failure Rate: -; ComponentLink1URL: http://industrial.panasonic.com/www-cgi/jvcr13pz.cgi?E+PZ+3+AOA0002+ERJ3EKF5620V+7+WW; ComponentLink1Description: http://industrial.panasonic.com/www-cgi/jvcr13pz.cgi?E+PZ+3+AOA0002+ERJ3EKF5620V+7+WW; Supplier Part Number 1: P562HCT-ND
R3-R5 = ERJ-3GEYJ103V: RES 10K OHM 1/10W 5% 0603 SMD; Manufacturer: Panasonic - ECG; Temperature Coefficient: ±200ppm/°C; Supplier 1: Digi-Key; Manufacturer Part Number: ERJ-3GEYJ103V; RoHS: RoHS Compliant; Category: Resistors; Stock 1: 16219504; Pricing 1: 1=0.02, 50=0.0092, 100=0.007, 250=0.0052, 500=0.00384, 1000=0.00256 (USD); Composition: Thick Film; Features: -; Tolerance: ±5%; Package / Case: 0603 (1608 Metric); Size / Dimension: 0.063" L x 0.031" W (1.60mm x 0.80mm); Height: 0.022" (0.55mm); Number of Terminations: 2; Packaging: Cut Tape (CT); ComponentLink1URL: http://industrial.panasonic.com/www-cgi/jvcr13pz.cgi?E+PZ+3+AOA0001+ERJ3GEYJ103V+7+WW; ComponentLink1Description: http://industrial.panasonic.com/www-cgi/jvcr13pz.cgi?E+PZ+3+AOA0001+ERJ3GEYJ103V+7+WW; Supplier Part Number 1: P10KGCT-ND
U1 = AD1939YSTZ: Single-chip codec that prvides 4 ADCs with differential input and 8 DACs with differential output; Manufacturer: Analog Devices Inc.; Data Interface: Serial; Resolution (Bits): 24 b; Number of ADCs / DACs: 4 / 8; Sigma Delta: Yes; S/N Ratio, ADCs / DACs (db) Typ: 94 / 94; Dynamic Range, ADCs / DACs (db) Typ: 105 / 110; Voltage - Supply, Analog: 3 V ~ 3.6 V; Notes: FE Provides; Supplier 1: Digi-Key; RoHS: RoHS Compliant; Category: Integrated Circuits (ICs); Stock 1: 432; Pricing 1: 1=15.81, 10=14.527, 100=12.269, 500=10.91416, 1000=10.01091, 2500=9.63456, 5000=9.33348 (USD); Packaging: Tray; Type: General Purpose; Voltage - Supply, Digital: 3 V ~ 3.6 V; Operating Temperature: -40°C ~ 105°C; Mounting Type: Surface Mount; Package / Case: 64-LQFP; Supplier Device Package: 64-LQFP (10x10); ComponentLink1URL: http://www.analog.com/media/en/technical-documentation/data-sheets/AD1939.pdf; ComponentLink1Description: http://www.analog.com/media/en/technical-documentation/data-sheets/AD1939.pdf; Supplier Part Number 1: AD1939YSTZ-ND; Manufacturer Part Number: AD1939YSTZ
Y1 = ABM3B-12.288MHZ-10-1-U-T: 12.288MHz ±10ppm Crystal 10pF 70 Ohm -10°C ~ 60°C Surface Mount 4-SMD, No Lead (DFN, LCC); Manufacturer: Abracon LLC; ESR (Equivalent Series Resistance): 70 Ohm; Operating Mode: Fundamental; Notes: FE Provides; Supplier 1: Digi-Key; RoHS: RoHS Compliant; Category: Crystals and Oscillators; Stock 1: 1220; Pricing 1: 1=1.09, 10=0.968, 50=0.904, 100=0.8, 500=0.756 (USD); Packaging: Cut Tape (CT); Part Status: Active; Type: MHz Crystal; Frequency: 12.288MHz; Frequency Stability: ±10ppm; Frequency Tolerance: ±10ppm; Load Capacitance: 10pF; Operating Temperature: -10°C ~ 60°C; Ratings: -; Mounting Type: Surface Mount; Package / Case: 4-SMD, No Lead (DFN, LCC); Size / Dimension: 0.197" L x 0.126" W (5.00mm x 3.20mm); Height: 0.043" (1.10mm); ComponentLink1URL: http://www.abracon.com/Resonators/abm3b.pdf; ComponentLink1Description: http://www.abracon.com/Resonators/abm3b.pdf; Supplier Part Number 1: 300-8198-1-ND; Manufacturer Part Number: ABM3B-12.288MHZ-10-1-U-T

## Sheet Audio_Input_Line_In.SchDoc: Audio Input: Line In
size 279 x 215 mm; DrawnBy: Connor Dack; Engineer: Connor Dack; DocumentNumber: 12; Revision: 1.0; SheetNumber: 12; SheetTotal: 20
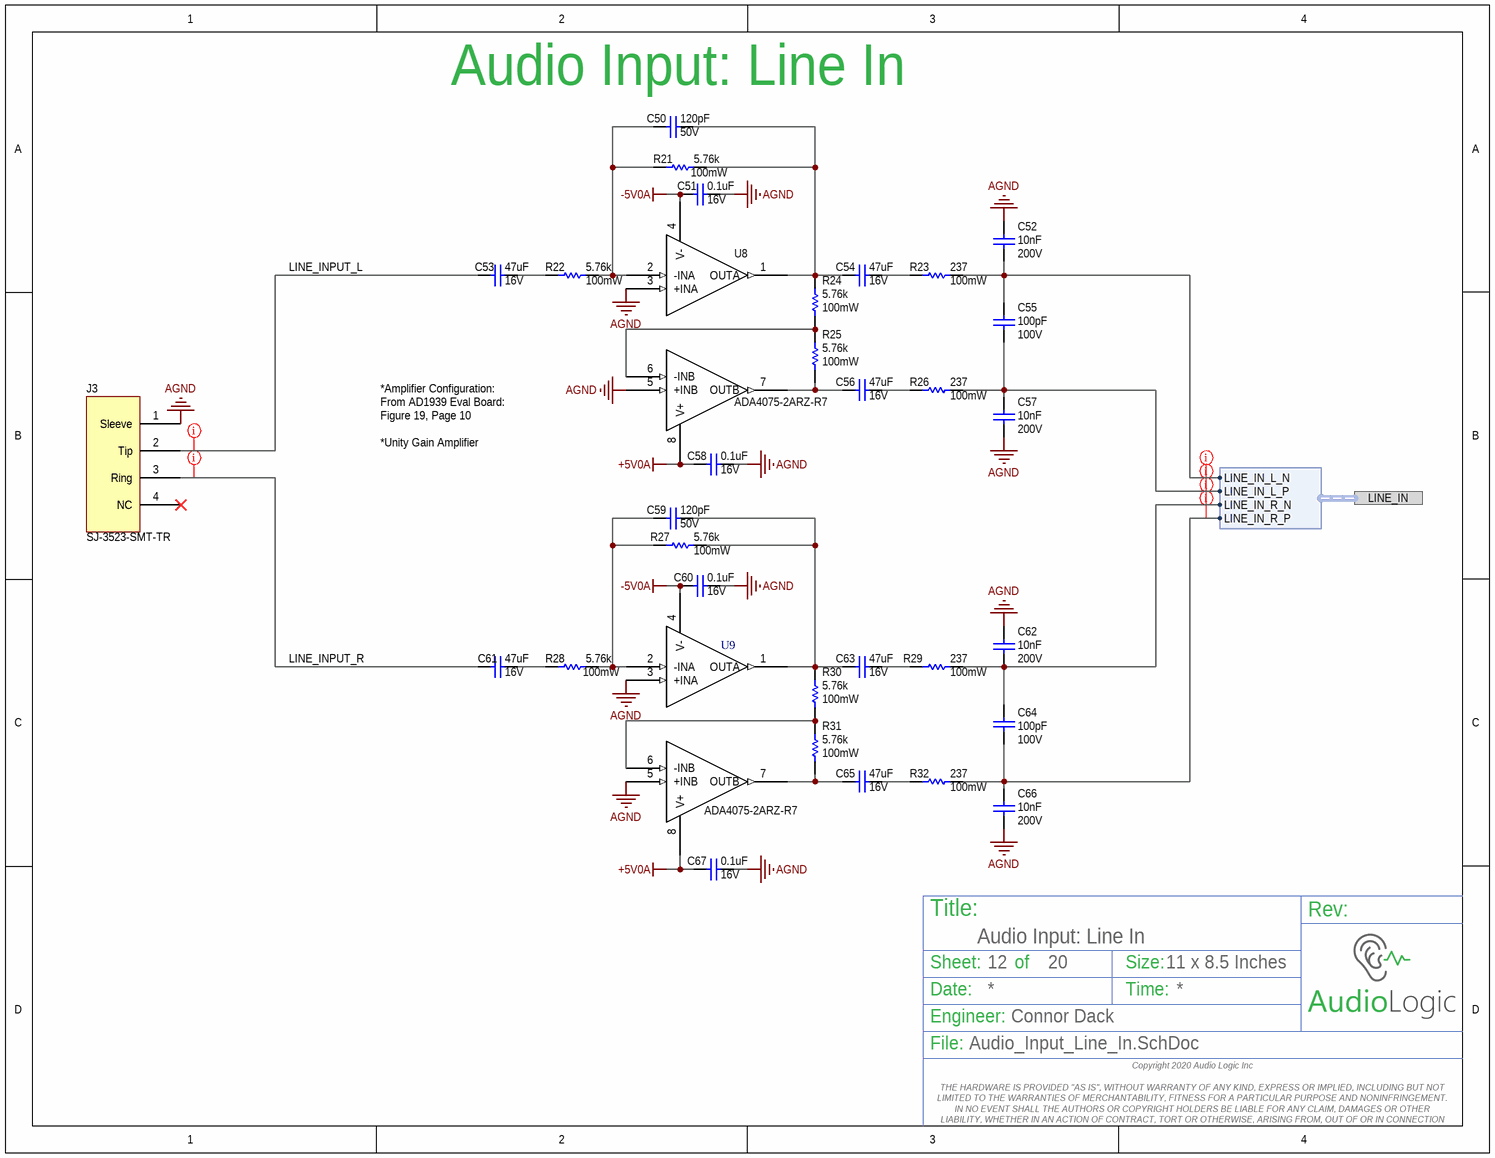
[diagram p4: Audio_Input_Line_In.SchDoc]

### Parts
C50  Voltage - Rated: 50V  Capacitance: 120pF  [3-0603_L]  (hidden comment: CL10C121JB8NCNC)
C51  Voltage Rating: 16V  Capacitance: 0.1uF  [3-0603_L]  (hidden comment: CL10F104ZO8NNNC)
C52  Voltage Rating: 200V  Capacitance: 10nF  [3-0603_L]
C53  Voltage Rating: 16V  Capacitance: 47uF  [C1210X25_L]  (hidden comment: CL32A476KOJNNNE)
C54  Voltage Rating: 16V  Capacitance: 47uF  [C1210X25_L]  (hidden comment: CL32A476KOJNNNE)
C55  Voltage - Rated: 100V  Capacitance: 100pF  [3-0603_L]  (hidden comment: C1608C0G2A101J)
C56  Voltage Rating: 16V  Capacitance: 47uF  [C1210X25_L]  (hidden comment: CL32A476KOJNNNE)
C57  Voltage Rating: 200V  Capacitance: 10nF  [3-0603_L]
C58  Voltage Rating: 16V  Capacitance: 0.1uF  [3-0603_L]  (hidden comment: CL10F104ZO8NNNC)
C59  Voltage - Rated: 50V  Capacitance: 120pF  [3-0603_L]  (hidden comment: CL10C121JB8NCNC)
C60  Voltage Rating: 16V  Capacitance: 0.1uF  [3-0603_L]  (hidden comment: CL10F104ZO8NNNC)
C61  Voltage Rating: 16V  Capacitance: 47uF  [C1210X25_L]  (hidden comment: CL32A476KOJNNNE)
C62  Voltage Rating: 200V  Capacitance: 10nF  [3-0603_L]
C63  Voltage Rating: 16V  Capacitance: 47uF  [C1210X25_L]  (hidden comment: CL32A476KOJNNNE)
C64  Voltage - Rated: 100V  Capacitance: 100pF  [3-0603_L]  (hidden comment: C1608C0G2A101J)
C65  Voltage Rating: 16V  Capacitance: 47uF  [C1210X25_L]  (hidden comment: CL32A476KOJNNNE)
C66  Voltage Rating: 200V  Capacitance: 10nF  [3-0603_L]
C67  Voltage Rating: 16V  Capacitance: 0.1uF  [3-0603_L]  (hidden comment: CL10F104ZO8NNNC)
J3  SJ-3523-SMT-TR  [SJ-3523-SMT-TR]
R21  Power (Watts): 100mW  Resistance (Ohms): 5.76k  [3-0603_R_L]  (hidden comment: ERJ-3EKF5761V)
R22  Power (Watts): 100mW  Resistance (Ohms): 5.76k  [3-0603_R_L]  (hidden comment: ERJ-3EKF5761V)
R23  Power (Watts): 100mW  Resistance (Ohms): 237  [3-0603_R_L]  (hidden comment: ERJ-3EKF2370V)
R24  Power (Watts): 100mW  Resistance (Ohms): 5.76k  [3-0603_R_L]  (hidden comment: ERJ-3EKF5761V)
R25  Power (Watts): 100mW  Resistance (Ohms): 5.76k  [3-0603_R_L]  (hidden comment: ERJ-3EKF5761V)
R26  Power (Watts): 100mW  Resistance (Ohms): 237  [3-0603_R_L]  (hidden comment: ERJ-3EKF2370V)
R27  Power (Watts): 100mW  Resistance (Ohms): 5.76k  [3-0603_R_L]  (hidden comment: ERJ-3EKF5761V)
R28  Power (Watts): 100mW  Resistance (Ohms): 5.76k  [3-0603_R_L]  (hidden comment: ERJ-3EKF5761V)
R29  Power (Watts): 100mW  Resistance (Ohms): 237  [3-0603_R_L]  (hidden comment: ERJ-3EKF2370V)
R30  Power (Watts): 100mW  Resistance (Ohms): 5.76k  [3-0603_R_L]  (hidden comment: ERJ-3EKF5761V)
R31  Power (Watts): 100mW  Resistance (Ohms): 5.76k  [3-0603_R_L]  (hidden comment: ERJ-3EKF5761V)
R32  Power (Watts): 100mW  Resistance (Ohms): 237  [3-0603_R_L]  (hidden comment: ERJ-3EKF2370V)
U8  ADA4075-2ARZ-R7  [SOIC127P600X175-8L]
U9  ADA4075-2ARZ-R7  [SOIC127P600X175-8L]

### Ports
LINE_IN (harness LINE_IN)

### Harnesses
LINE_IN: LINE_IN_R_P, LINE_IN_R_N, LINE_IN_L_N, LINE_IN_L_P

### Nets
+5V0A: C58.2 C67.2 U8.8(V+) U9.8(V+)
-5V0A: C51.2 C60.2 U8.4(V-) U9.4(V-)
AGND: C51.1 C52.2 C57.1 C58.1 C60.1 C62.2 C66.1 C67.1 J3.1(Sleeve) U8.3(+INA) U8.5(+INB) U9.3(+INA) U9.5(+INB)
LINE_INPUT_L: C53.1 J3.2(Tip)
LINE_INPUT_R: C61.1 J3.3(Ring)
NetC50_1: C50.1 R21.1 R22.2 U8.2(-INA)
NetC50_2: C50.2 C54.1 R21.2 R24.1 U8.1(OUTA)
NetC52_1: C52.1 C55.2 R23.2 ; port LINE_IN.LINE_IN_L_N
NetC53_2: C53.2 R22.1
NetC54_2: C54.2 R23.1
NetC55_1: C55.1 C57.2 R26.2 ; port LINE_IN.LINE_IN_L_P
NetC56_1: C56.1 R25.1 U8.7(OUTB)
NetC56_2: C56.2 R26.1
NetC59_1: C59.1 R27.1 R28.2 U9.2(-INA)
NetC59_2: C59.2 C63.1 R27.2 R30.2 U9.1(OUTA)
NetC61_2: C61.2 R28.1
NetC62_1: C62.1 C64.2 R29.2 ; port LINE_IN.LINE_IN_R_N
NetC63_2: C63.2 R29.1
NetC64_1: C64.1 C66.2 R32.2 ; port LINE_IN.LINE_IN_R_P
NetC65_1: C65.1 R31.1 U9.7(OUTB)
NetC65_2: C65.2 R32.1
NetR24_2: R24.2 R25.2 U8.6(-INB)
NetR30_1: R30.1 R31.2 U9.6(-INB)

Not connected (* = marked no-connect by the designer): J3 4(NC)*

### Layout directives
net class Line_In: NetC52_1, NetC55_1, NetC62_1, NetC64_1
net class Line_In_3.5mm: LINE_INPUT_L, LINE_INPUT_R

### Notes on the sheet
- (near C50) Audio Input: Line In
- *Amplifier Configuration: From AD1939 Eval Board: Figure 19, Page 10
  *Unity Gain Amplifier
- Title:
- Sheet:
- of
- Size:
- 11 x 8.5 Inches
- Rev:
- Date:
- Engineer:
- Time:
- File:
- Copyright 2020 Audio Logic Inc
  THE HARDWARE IS PROVIDED "AS IS", WITHOUT WARRANTY OF ANY KIND, EXPRESS OR IMPLIED, INCLUDING BUT NOT LIMITED TO THE WARRANTIES OF MERCHANTABILITY, FITNESS FOR A PARTICULAR PURPOSE AND NONINFRINGEMENT. IN NO EVENT SHALL THE AUTHORS OR COPYRIGHT HOLDERS BE LIABLE FOR ANY CLAIM, DAMAGES OR OTHER LIABILITY, WHETHER IN AN ACTION OF CONTRACT, TORT OR OTHERWISE, ARISING FROM, OUT OF OR IN CONNECTION WITH THE HARDWARE OR THE USE OR OTHER DEALINGS IN THE HARDWARE.

### Library data of the parts
C50 C59 = CL10C121JB8NCNC: 120pF 50V Ceramic Capacitor C0G, NP0 0603 (1608 Metric) 0.063" L x 0.031" W (1.60mm x 0.80mm); Manufacturer: Samsung Electro-Mechanics America, Inc.; Tolerance: ±5%; Supplier 1: Digi-Key; Manufacturer Part Number: CL10C121JB8NCNC; RoHS: RoHS Compliant; Category: Capacitors; Stock 1: 26285; Pricing 1: 1=0.1, 10=0.03, 25=0.0208, 50=0.016, 100=0.0135, 500=0.00948, 1000=0.00738 (USD); Packaging: Cut Tape (CT); Part Status: Active; Temperature Coefficient: C0G, NP0; Mounting Type: Surface Mount, MLCC; Operating Temperature: -55°C ~ 125°C; Applications: General Purpose; Ratings: -; Package / Case: 0603 (1608 Metric); Size / Dimension: 0.063" L x 0.031" W (1.60mm x 0.80mm); Height - Seated (Max): -; Thickness (Max): 0.035" (0.90mm); Lead Spacing: -; Features: -; Lead Style: -; ComponentLink1URL: http://media.digikey.com/pdf/Data%20Sheets/Samsung%20PDFs/CL10C121JB8NCNC_Spec.pdf; ComponentLink1Description: http://media.digikey.com/pdf/Data%20Sheets/Samsung%20PDFs/CL10C121JB8NCNC_Spec.pdf; Supplier Part Number 1: 1276-2180-1-ND; Load Status: *
C51 C58 C60 C67 = CL10F104ZO8NNNC: as C3 on sheet Audio_Codec; Supplier 1: Digi-Key; Stock 1: 40000; Pricing 1: 1=0.1, 10=0.038, 100=0.0169, 500=0.01208, 1000=0.00949 (USD); Mount: Surface Mount; Case/Package: 0603; Case Code (Metric): 1608; Case Code (Imperial): 0603; Min Operating Temperature: -30°C; Max Operating Temperature: 85°C; Package Quantity: 1; Packaging: Tape and Reel; Dielectric: Y5V; Length: 1.6mm; Height: 0.8mm; Width: 0.031inch; Thickness: 0.035inch; Depth: 0.8mm; Radiation Hardening: No; ComponentLink1URL: https://datasheet.ciiva.com/25805/cl10f104zo8nnnc-25805810.pdf; ComponentLink1Description: https://datasheet.ciiva.com/25805/cl10f104zo8nnnc-25805810.pdf; ComponentLink2URL: https://datasheet.ciiva.com/16199/cl10f104zo8nnnc-16199254.pdf; ComponentLink2Description: https://datasheet.ciiva.com/16199/cl10f104zo8nnnc-16199254.pdf; Supplier Part Number 1: 1276-1258-6-ND; Manufacturer Part Number: CL10F104ZO8NNNC
C52 C57 C62 C66 = C1608C0G1H050C080AA: CAP CER 10000PF 200V X7R 0603; Manufacturer: KEMET; Dielectric Material: Ceramic; Tolerance: 5%; Supplier 1: Digi-Key; Manufacturer Part Number: C0603C103J2RACTU; Stock 1: 2052; Pricing 1: 1=0.57, 10=0.392, 100=0.2355, 500=0.1766, 1000=0.14913 (USD); Mount: Surface Mount; Case/Package: 0603; Case Code (Metric): 1608; Case Code (Imperial): 0603; Min Operating Temperature: -55°C; Max Operating Temperature: 125°C; Package Quantity: 1; Packaging: Tape and Reel; Voltage Rating (DC): 200V; Dielectric: X7R; Termination: SMD/SMT; Length: 1.6mm; Height: 0.8mm; Width: 0.031inch; Thickness: 0.034inch; ComponentLink1URL: https://search.kemet.com/component-edge/download/datasheet/C0603C103J2RACTU.pdf; ComponentLink1Description: https://search.kemet.com/component-edge/download/datasheet/C0603C103J2RACTU.pdf; ComponentLink2URL: http://www.kemet.com/Lists/ProductCatalog/Attachments/53/KEM_C1002_X7R_SMD.pdf; ComponentLink2Description: http://www.kemet.com/Lists/ProductCatalog/Attachments/53/KEM_C1002_X7R_SMD.pdf; Supplier Part Number 1: 399-10040-6-ND
C53 C54 C56 C61 C63 C65 = CL32A476KOJNNNE: as C5 on sheet Audio_Codec; Supplier 1: Digi-Key; Manufacturer Part Number: CL32A476KOJNNNE; Stock 1: 10000; Pricing 1: 1=1.12, 10=0.853, 100=0.6104, 500=0.47254 (USD); Mount: Surface Mount; Case/Package: 1210; Case Code (Metric): 3225; Case Code (Imperial): 1210; Min Operating Temperature: -55°C; Max Operating Temperature: 85°C; Package Quantity: 1; Packaging: Tape and Reel; Dielectric: X5R; Voltage Rating (DC): 16V; Length: 0.126inch; Width: 0.098inch; Thickness: 0.106inch; Lead Free: Lead Free; ComponentLink1URL: https://datasheet.ciiva.com/25785/cl32a476kojnnne-25785873.pdf; ComponentLink1Description: https://datasheet.ciiva.com/25785/cl32a476kojnnne-25785873.pdf; Supplier Part Number 1: 1276-3376-6-ND
C55 C64 = C1608C0G2A101J: CAP CER 100PF 100V 5% NP0 0603; Manufacturer: TDK Corporation; Temperature Coefficient: C0G, NP0; Supplier 1: Digi-Key; Manufacturer Part Number: C1608C0G2A101J; RoHS: RoHS Compliant; Category: Capacitors; Stock 1: 128588; Pricing 1: 10=0.05, 100=0.0231, 250=0.01892, 500=0.01618, 1000=0.0126 (USD); Tolerance: ±5%; Mounting Type: Surface Mount, MLCC; Operating Temperature: -55°C ~ 125°C; Applications: General Purpose; Ratings: -; Package / Case: 0603 (1608 Metric); Size / Dimension: 0.063" L x 0.031" W (1.60mm x 0.80mm); Height - Seated (Max): -; Thickness (Max): 0.037" (0.95mm); Lead Spacing: -; Features: -; Packaging: Cut Tape (CT); Lead Style: -; ComponentLink1URL: http://www.tdk.com/pdf/mid_volt_B11.pdf; ComponentLink1Description: http://www.tdk.com/pdf/mid_volt_B11.pdf; Supplier Part Number 1: 445-2306-1-ND; Load Status: *
J3 = SJ-3523-SMT-TR: 3.50mm (0.141", 1/8", Mini Plug) - Headphone Phone Jack Stereo Connector Solder; Manufacturer: CUI Inc.; Gender: Female; Actual Diameter: 0.142" (3.60mm); Number of Positions/Contacts: 3 Conductors, 3 Contacts; Internal Switch(s): Does Not Contain Switch; Shielding: Unshielded; Voltage - Rated: 12VDC; Current Rating: 1A; Mating Length/Depth: 0.551" (14.00mm); Body Color: Black; Includes: 1 pc - 1 Connector; Notes: FE Provides: 23; LatestRevisionDate: 17-Jul-2002; LatestRevisionNote: Re-released for DXP Platform.; Publisher: Altium Limited; Supplier 1: Digi-Key; RoHS: RoHS Compliant; Category: Connectors, Interconnects; Stock 1: 104981; Pricing 1: 1=1.34, 10=1.043, 100=0.7961, 500=0.63558 (USD); Packaging: Cut Tape (CT); Part Status: Active; Connector Type: Phone Jack; Signal Lines: Stereo; Industry Recognized Mating Diameter: 3.50mm (0.141", 1/8", Mini Plug) - Headphone; Mounting Type: Surface Mount, Right Angle; Termination: Solder; Features: Board Guide; Insulation Color: -; Contact Material - Plating: Silver; Body Material: -; ComponentLink1URL: http://www.cui.com/product/resource/digikeypdf/sj-352x-smt_series.pdf; ComponentLink1Description: http://www.cui.com/product/resource/digikeypdf/sj-352x-smt_series.pdf; Supplier Part Number 1: CP-3523SJCT-ND; Manufacturer Part Number: SJ-3523-SMT-TR
R21 R22 R24 R25 R27 R28 R30 R31 = ERJ-3EKF5761V: RES SMD 5.76K OHM 1% 1/10W 0603; Manufacturer: Panasonic Electronic Components; Temperature Coefficient: ±100ppm/°C; Supplier 1: Digi-Key; Manufacturer Part Number: ERJ-3EKF5761V; RoHS: RoHS Compliant; Category: Resistors; Stock 1: 90842; Pricing 1: 1=0.1, 50=0.0114, 100=0.0084, 250=0.00644, 500=0.00514, 1000=0.00379 (USD); Packaging: Cut Tape (CT); Part Status: Active; Tolerance: ±1%; Composition: Thick Film; Features: Automotive AEC-Q200; Operating Temperature: -55°C ~ 155°C; Package / Case: 0603 (1608 Metric); Supplier Device Package: 0603; Size / Dimension: 0.063" L x 0.031" W (1.60mm x 0.80mm); Height: 0.022" (0.55mm); Number of Terminations: 2; ComponentLink1URL: http://industrial.panasonic.com/www-cgi/jvcr13pz.cgi?E+PZ+3+AOA0002+ERJ3EKF5761V+7+WW; ComponentLink1Description: http://industrial.panasonic.com/www-cgi/jvcr13pz.cgi?E+PZ+3+AOA0002+ERJ3EKF5761V+7+WW; Supplier Part Number 1: P5.76KHCT-ND; Load Status: *
R23 R26 R29 R32 = ERJ-3EKF2370V: RES SMD 237 OHM 1% 1/10W 0603; Manufacturer: Panasonic Electronic Components; Temperature Coefficient: ±100ppm/°C; Supplier 1: Digi-Key; Manufacturer Part Number: ERJ-3EKF2370V; RoHS: RoHS Compliant; Category: Resistors; Stock 1: 74413; Pricing 1: 1=0.1, 50=0.0114, 100=0.0084, 250=0.00644, 500=0.00514, 1000=0.00379 (USD); Packaging: Cut Tape (CT); Part Status: Active; Tolerance: ±1%; Composition: Thick Film; Features: Automotive AEC-Q200; Operating Temperature: -55°C ~ 155°C; Package / Case: 0603 (1608 Metric); Supplier Device Package: 0603; Size / Dimension: 0.063" L x 0.031" W (1.60mm x 0.80mm); Height: 0.022" (0.55mm); Number of Terminations: 2; ComponentLink1URL: http://industrial.panasonic.com/www-cgi/jvcr13pz.cgi?E+PZ+3+AOA0002+ERJ3EKF2370V+7+WW; ComponentLink1Description: http://industrial.panasonic.com/www-cgi/jvcr13pz.cgi?E+PZ+3+AOA0002+ERJ3EKF2370V+7+WW; Supplier Part Number 1: P237HCT-ND; Load Status: *
U8 U9 = ADA4075-2ARZ-R7: IC OPAMP GP 6.5MHZ 8SOIC; Manufacturer: Analog Devices Inc.; Amplifier Type: General Purpose; Number of Circuits: 2; Slew Rate: 12 V/µs; Current - Input Bias: 30nA; Voltage - Input Offset: 200µV; Current - Supply: 1.8mA; Current - Output / Channel: 40mA; Voltage - Supply, Single/Dual (±): ±4.5 V ~ 18 V; Supplier 1: Digi-Key; RoHS: RoHS Compliant; Category: Integrated Circuits (ICs); Stock 1: 11196; Pricing 1: 1=2.28, 10=2.05, 100=1.6441, 500=1.35136 (USD); Packaging: Cut Tape (CT); Part Status: Active; Output Type: -; Gain Bandwidth Product: 6.5MHz; -3db Bandwidth: -; Operating Temperature: -40°C ~ 125°C; Mounting Type: Surface Mount; Package / Case: 8-SOIC (0.154", 3.90mm Width); Supplier Device Package: 8-SOIC; ComponentLink1URL: http://www.analog.com/media/en/technical-documentation/data-sheets/ADA4075-2.pdf; ComponentLink1Description: http://www.analog.com/media/en/technical-documentation/data-sheets/ADA4075-2.pdf; Supplier Part Number 1: ADA4075-2ARZ-R7CT-ND; Manufacturer Part Number: ADA4075-2ARZ-R7